# Altium project PCA10ControlBoard.PrjPcb
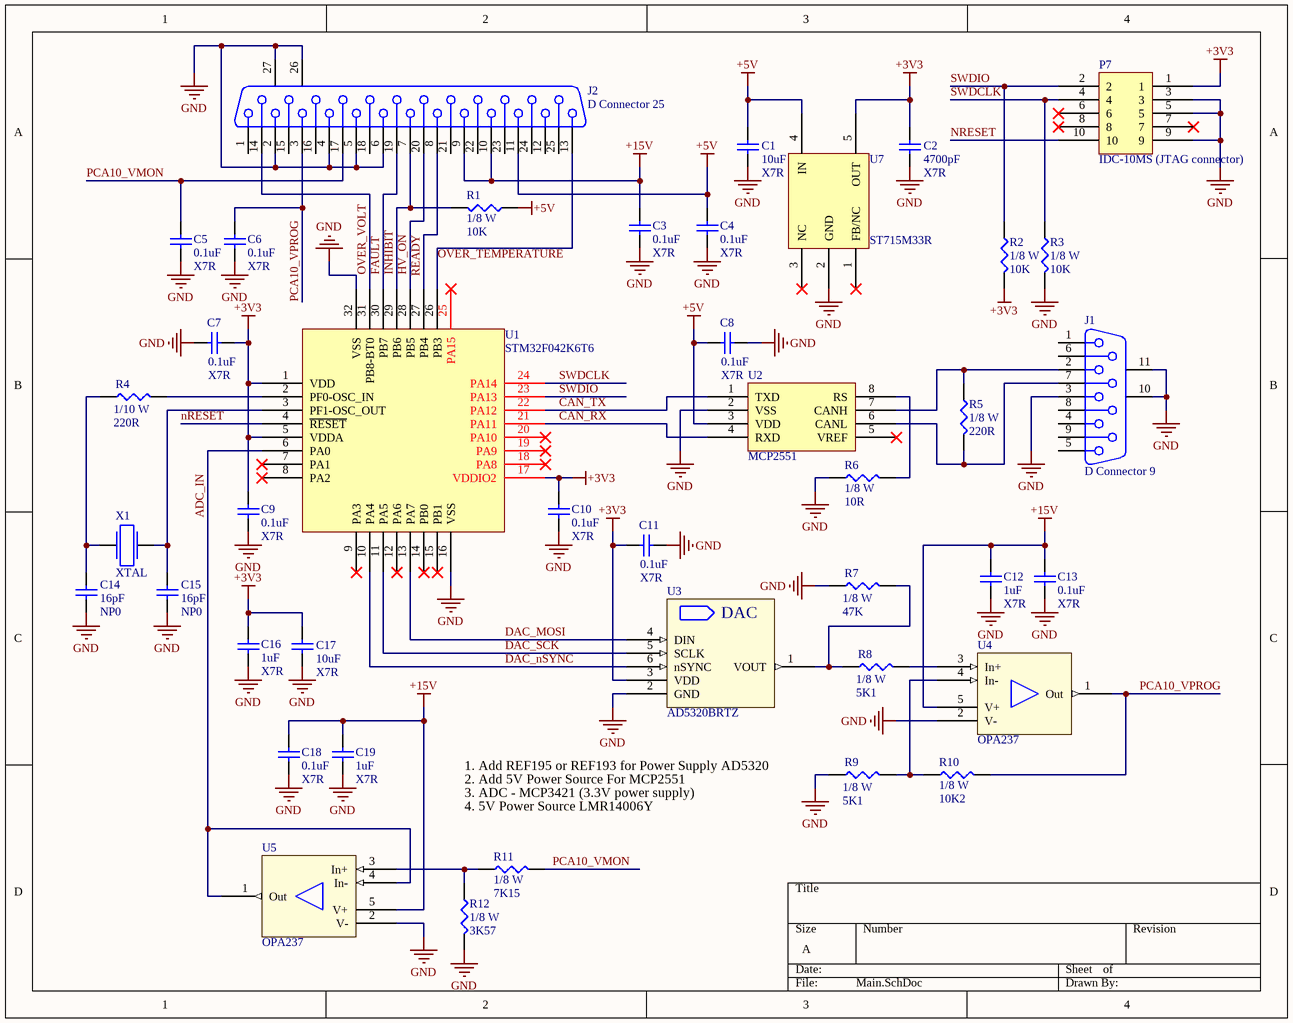
[diagram p0: Main.SchDoc]
1 sheet, 41 parts. Net scope: global (net labels, ports and power ports of the same name join across sheets).
Board file: PCA10ControlBoardV1.0.PcbDoc

## Sheet Main.SchDoc
size A

### Parts
C1  value 10uF  Type: X7R  [CAP0805]  (hidden comment: ChipCap 10u X7R)
C2  value 4700pF  Type: X7R  [CAP0603]  (hidden comment: ChipCap 4700 X7R)
C3  value 0.1uF  Type: X7R  [CAP0603]  (hidden comment: ChipCap 0.1u X7R)
C4  value 0.1uF  Type: X7R  [CAP0603]  (hidden comment: ChipCap 0.1u X7R)
C5  value 0.1uF  Type: X7R  [CAP0603]  (hidden comment: ChipCap 0.1u X7R)
C6  value 0.1uF  Type: X7R  [CAP0603]  (hidden comment: ChipCap 0.1u X7R)
C7  value 0.1uF  Type: X7R  [CAP0603]  (hidden comment: ChipCap 0.1u X7R)
C8  value 0.1uF  Type: X7R  [CAP0603]  (hidden comment: ChipCap 0.1u X7R)
C9  value 0.1uF  Type: X7R  [CAP0603]  (hidden comment: ChipCap 0.1u X7R)
C10  value 0.1uF  Type: X7R  [CAP0603]  (hidden comment: ChipCap 0.1u X7R)
C11  value 0.1uF  Type: X7R  [CAP0603]  (hidden comment: ChipCap 0.1u X7R)
C12  value 1uF  Type: X7R  [CAP0805]  (hidden comment: ChipCap 1u X7R)
C13  value 0.1uF  Type: X7R  [CAP0603]  (hidden comment: ChipCap 0.1u X7R)
C14  value 16pF  Type: NP0  [CAP0603]  (hidden comment: CAP0603 16pF NP0)
C15  value 16pF  Type: NP0  [CAP0603]  (hidden comment: CAP0603 16pF NP0)
C16  value 1uF  Type: X7R  [CAP0805]  (hidden comment: ChipCap 1u X7R)
C17  value 10uF  Type: X7R  [CAP0805]  (hidden comment: ChipCap 10u X7R)
C18  value 0.1uF  Type: X7R  [CAP0603]  (hidden comment: ChipCap 0.1u X7R)
C19  value 1uF  Type: X7R  [CAP0805]  (hidden comment: ChipCap 1u X7R)
J1  D Connector 9  [DSUB1.385-2H9F]
J2  D Connector 25  [DSUB1.385-2H25A-F]
P7  IDC-10MS (JTAG connector)  [IDC-10MS(MR)]
R1  value 10K  Rating: 1/8 W  [RES0603]  (hidden comment: RES0805 10K 1%)
R2  value 10K  Rating: 1/8 W  [RES0603]  (hidden comment: RES0805 10K 1%)
R3  value 10K  Rating: 1/8 W  [RES0603]  (hidden comment: RES0805 10K 1%)
R4  value 220R  Rating: 1/10 W  [RES0603]  (hidden comment: ChipRes 220R 1%)
R5  value 220R  Rating: 1/8 W  [RES0603]  (hidden comment: RES0805 10K 1%)
R6  value 10R  Rating: 1/8 W  [RES0603]  (hidden comment: RES0805 10K 1%)
R7  value 47K  Rating: 1/8 W  [RES0603]  (hidden comment: RES0805 47K 1%)
R8  value 5K1  Rating: 1/8 W  [RES0603]  (hidden comment: RES0805 5K1 1%)
R9  value 5K1  Rating: 1/8 W  [RES0603]  (hidden comment: RES0805 5K1 1%)
R10  value 10K2  Rating: 1/8 W  [RES0603]  (hidden comment: RES0805 10K 1%)
R11  value 7K15  Rating: 1/8 W  [RES0805]  (hidden comment: RES0805 10K 1%)
R12  value 3K57  Rating: 1/8 W  [RES0805]  (hidden comment: RES0805 10K 1%)
U1  STM32F042K6T6  [LQFP32]
U2  MCP2551  [SOIC8]
U3  AD5320BRTZ  [SOT23-6]
U4  OPA237  [SOT23-6]
U5  OPA237  [SOT23-6]
U7  ST715M33R  [SOT23-5]
X1  XTAL  [ABM3 Ceramic Crystal]

### Nets
+3V3: C2.2 C7.2 C9.2 C10.2 C11.1 C16.2 C17.2 P7.1 R2.2 U1.1(VDD) U1.5(VDDA) U1.17(VDDIO2) U3.3(VDD) U7.5(OUT)
+5V: C1.2 C4.2 C8.1 J2.11 R1.1 U2.3(VDD) U7.4(IN)
+15V: C3.2 C12.2 C13.2 C18.2 C19.2 J2.9 J2.10 U4.5(V+) U5.5(V+)
GND: C1.1 C2.1 C3.1 C4.1 C5.2 C6.2 C7.1 C8.2 C9.1 C10.1 C11.2 C12.1 C13.1 C14.1 C15.1 C16.1 C17.1 C18.1 C19.1 J1.3 J1.10(MH1) J1.11(MH2) J2.2 J2.4 J2.5 J2.6 J2.26(MH1) J2.27(MH2) P7.3 P7.5 P7.9 R3.2 R6.1 R7.1 R9.1 R12.2 U1.16(VSS) U1.32(VSS) U2.2(VSS) U3.2(GND) U4.2(V-) U5.2(V-) U7.2(GND)
ADC_IN: U1.6(PA0) U5.1(Out) U5.4(In-)
CAN_RX: U1.21(PA11) U2.4(RXD)
CAN_TX: U1.22(PA12) U2.1(TXD)
DAC_MOSI: U1.13(PA7) U3.4(DIN)
DAC_nSYNC: U1.10(PA4) U3.6(nSYNC)
DAC_SCK: U1.11(PA5) U3.5(SCLK)
FAULT: J2.19 U1.30(PB7)
HV_ON: J2.20 U1.28(PB5)
INHIBIT: J2.7 R1.2 U1.29(PB6)
nRESET: P7.10 U1.4(~{RESET})
OVER_TEMPERATURE: J2.13 U1.26(PB3)
OVER_VOLT: J2.14 U1.31(PB8-BT0)
PCA10_VMON: C5.1 J2.17 R11.2
PCA10_VPROG: C6.1 J2.3 R10.2 U4.1(Out)
READY: J2.8 U1.27(PB4)
SWDCLK: P7.4 R3.1 U1.24(PA14)
SWDIO: P7.2 R2.1 U1.23(PA13)
NetC14_2: C14.2 R4.1 X1.1
NetC15_2: C15.2 U1.3(PF1-OSC_OUT) X1.2
NetJ1_2: J1.2 R5.1 U2.7(CANH)
NetJ1_7: J1.7 R5.2 U2.6(CANL)
NetR4_2: R4.2 U1.2(PF0-OSC_IN)
NetR6_2: R6.2 U2.8(RS)
NetR7_2: R7.2 R8.1 U3.1(VOUT)
NetR8_2: R8.2 U4.3(In+)
NetR9_2: R9.2 R10.1 U4.4(In-)
NetR11_1: R11.1 R12.1 U5.3(In+)

Not connected (* = marked no-connect by the designer): J1 1 4 5 6 8 9; J2 1 12 15 16 18 21 22 23 24 25; P7 6* 7* 8*; U1 7(PA1)* 8(PA2)* 9(PA3)* 12(PA6)* 14(PB0)* 15(PB1)* 18(PA8)* 19(PA9)* 20(PA10)* 25(PA15)*; U2 5(VREF)*; U7 1(FB/NC)* 3(NC)*

### Notes on the sheet
- 1. Add REF195 or REF193 for Power Supply AD5320
- 2. Add 5V Power Source For MCP2551
- 3. ADC - MCP3421 (3.3V power supply)
- 4. 5V Power Source LMR14006Y
- (in symbol AD5320BRTZ-500RL7) DAC

### Library data of the parts
C1 C17 = ChipCap 10uF X7R: Surface-mount ceramic multilayer capacitor; Manufacturer: YAGEO; Voltage: 25V; Tolerance: 10%; ComponentLink1Description: Datasheet; ComponentLink1URL: http://www.deaha.com/pdf/YAGEO-CC_series.pdf
C2 = ChipCap 4700 X7R: Surface-mount ceramic multilayer capacitor; Manufacturer: YAGEO; Voltage: 16V; Tolerance: 10%; ComponentLink1Description: Datasheet; ComponentLink1URL: http://www.deaha.com/pdf/YAGEO-CC_series.pdf
C3-C11 C13 C18 = ChipCap 0.1uF X7R: Surface-mount ceramic multilayer capacitor; Manufacturer: YAGEO; Voltage: 100V; Tolerance: 10%; ComponentLink1Description: Datasheet; ComponentLink1URL: http://www.deaha.com/pdf/YAGEO-CC_series.pdf
C12 C16 C19 = ChipCap 1uF X7R: Surface-mount ceramic multilayer capacitor; Manufacturer: YAGEO; Voltage: 25V; Tolerance: 10%; ComponentLink1Description: Datasheet; ComponentLink1URL: http://www.deaha.com/pdf/YAGEO-CC_series.pdf
C14 C15 = CAP0603 16pF NP0: Surface-mount ceramic multilayer capacitor; Manufacturer: YAGEO; Manufacturer Part Number: CC0603JRNPO9BN160; Voltage: 50V; Tolerance: 5%; ComponentLink1Description: Datasheet; ComponentLink1URL: http://www.deaha.com/pdf/YAGEO-CC_series.pdf
J1 = D Connector 9: Receptacle Assembly, 9 Position, Right Angle; Manufacturer Part Number: DRB-9FA; Manufacturer: CONNFLY; PackageDocument: O; Positions: 9; Published: 15-Jun-2001; LatestRevisionDate: 17-Jul-2002; LatestRevisionNote: Re-released for DXP Platform.; DatasheetDocument: 1-Sep-1999; PackageReference: 788750; Publisher: Altium Limited; Orientation: Right Angle; Gender: Receptacle
J2 = D Connector 25: Receptacle Assembly, 25 Position, Right Angle; PackageDocument: U; Positions: 25; Published: 15-Jun-2001; LatestRevisionDate: 17-Jul-2002; LatestRevisionNote: Re-released for DXP Platform.; DatasheetDocument: 19-Mar-1999; PackageReference: 787202; Publisher: Altium Limited; Orientation: Right Angle; Gender: Receptacle
R1-R3 R5 R6 R10-R12 = RES0805 10K 1%: Think Film Chip resistor; Manufacturer Part Number: RC0805FR-0710KL; Temperature Coefficient: 100ppm/K; Tolerance: 1%; Type: ThickFilm
R4 = ChipRes 220R 1%: Think Film Chip resistor; Temperature Coefficient: 200ppm/K; Tolerance: 1%; Type: ThickFilm
R7 = RES0805 47K 1%: Think Film Chip resistor; Manufacturer Part Number: RC0805JR-0747KL; Temperature Coefficient: 100ppm/K; Tolerance: 1%; Type: ThickFilm
R8 R9 = RES0805 5K1 1%: Think Film Chip resistor; Manufacturer Part Number: RC0805FR-075K1L; Temperature Coefficient: 100ppm/K; Tolerance: 1%; Type: ThickFilm
U1 = STM32F042K6T6: ARM Cortex-M0 Microcontroller
U2 = MCP2551-I/SN: CAN Transceiver
U3 = AD5320BRTZ-500RL7: Manufacturer: Analog Devices; Manufacturer Part Number: AD5320BRTZ
U4 U5 = OPA237NA: Operational Amplifier; Manufacturer: TI; Manufacturer Part Number: OPA237NA/250
U7 = ST715M33R: High input voltage - 85 mA LDO linear regulator
X1 = ABM3 Ceramic SMD Crystal: Quartz crystall oscillator